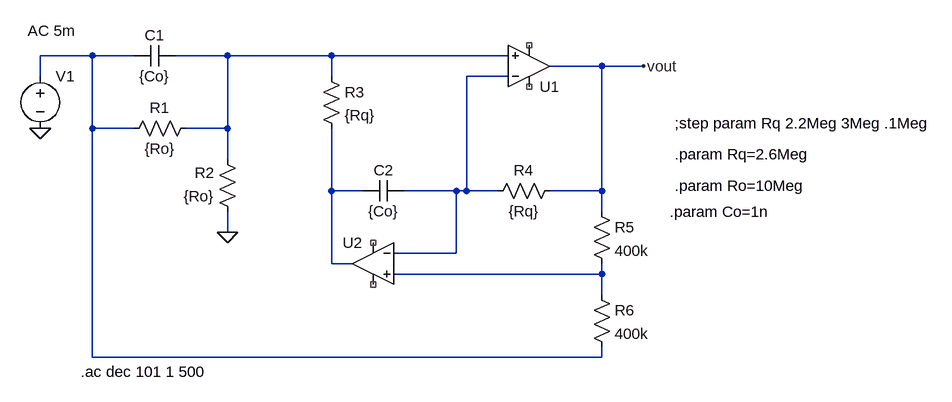
[diagram p0: schematic 60hz_notch_filter_active.asc]
60hz_notch_filter_active.asc, the LTspice schematic file:
Version 4
SHEET 1 1464 680
WIRE 144 0 64 0
WIRE 208 0 144 0
WIRE 352 0 272 0
WIRE 512 0 352 0
WIRE 784 0 512 0
WIRE 928 16 848 16
WIRE 992 16 928 16
WIRE 64 32 64 0
WIRE 512 32 512 0
WIRE 784 32 720 32
WIRE 144 112 144 0
WIRE 208 112 144 112
WIRE 352 112 352 0
WIRE 352 112 288 112
WIRE 352 160 352 112
WIRE 512 208 512 112
WIRE 560 208 512 208
WIRE 704 208 624 208
WIRE 720 208 720 32
WIRE 720 208 704 208
WIRE 768 208 720 208
WIRE 928 208 928 16
WIRE 928 208 848 208
WIRE 928 240 928 208
WIRE 352 272 352 240
WIRE 704 304 704 208
WIRE 704 304 608 304
WIRE 512 320 512 208
WIRE 544 320 512 320
WIRE 928 336 928 320
WIRE 928 336 608 336
WIRE 928 368 928 336
WIRE 144 464 144 112
WIRE 928 464 928 448
WIRE 928 464 144 464
FLAG 64 112 0
FLAG 352 272 0
FLAG 992 16 vout
SYMBOL voltage 64 16 R0
WINDOW 123 -19 -54 Left 2
WINDOW 39 0 0 Left 0
SYMATTR InstName V1
SYMATTR Value ""
SYMATTR Value2 AC 5m
SYMBOL cap 272 -16 R90
WINDOW 0 0 32 VBottom 2
WINDOW 3 32 32 VTop 2
SYMATTR InstName C1
SYMATTR Value {Co}
SYMBOL res 304 96 R90
WINDOW 0 0 56 VBottom 2
WINDOW 3 32 56 VTop 2
SYMATTR InstName R1
SYMATTR Value {Ro}
SYMBOL res 368 256 R180
WINDOW 0 36 76 Left 2
WINDOW 3 36 40 Left 2
SYMATTR InstName R2
SYMATTR Value {Ro}
SYMBOL res 496 16 R0
SYMATTR InstName R3
SYMATTR Value {Rq}
SYMBOL cap 624 192 R90
WINDOW 0 0 32 VBottom 2
WINDOW 3 32 32 VTop 2
SYMATTR InstName C2
SYMATTR Value {Co}
SYMBOL Opamps\\UniversalOpamp2 816 16 M180
SYMATTR InstName U1
SYMBOL Opamps\\UniversalOpamp2 576 320 M0
SYMATTR InstName U2
SYMBOL res 864 192 R90
WINDOW 0 0 56 VBottom 2
WINDOW 3 32 56 VTop 2
SYMATTR InstName R4
SYMATTR Value {Rq}
SYMBOL res 912 224 R0
SYMATTR InstName R5
SYMATTR Value 400k
SYMBOL res 912 352 R0
SYMATTR InstName R6
SYMATTR Value 400k
TEXT 126 486 Left 2 !.ac dec 101 1 500
TEXT 1040 152 Left 2 !.param Rq=2.6Meg
TEXT 1040 200 Left 2 !.param Ro=10Meg
TEXT 1032 240 Left 2 !.param Co=1n
TEXT 1040 104 Left 2 !;step param Rq 2.2Meg 3Meg .1Meg

The netlist it stands for:
* 60hz_notch_filter_active.asc
V1 N001 0 AC 5m
C1 N002 N001 {Co}
R1 N002 N001 {Ro}
R2 0 N002 {Ro}
R3 N002 N004 {Rq}
C2 N003 N004 {Co}
XU1 N002 N003 NC_01 NC_02 vout level.2 Avol=1Meg GBW=10Meg Slew=10Meg ilimit=25m rail=0 Vos=0 phimargin=45 en=0 enk=0 in=0 ink=0 Rin=500Meg  ; pins IN+ IN- V+ V- OUT
XU2 N005 N003 NC_03 NC_04 N004 level.2 Avol=1Meg GBW=10Meg Slew=10Meg ilimit=25m rail=0 Vos=0 phimargin=45 en=0 enk=0 in=0 ink=0 Rin=500Meg  ; pins IN+ IN- V+ V- OUT
R4 vout N003 {Rq}
R5 vout N005 400k
R6 N005 N001 400k
.ac dec 101 1 500
.param Rq=2.6Meg
.param Ro=10Meg
.param Co=1n
;step param Rq 2.2Meg 3Meg .1Meg
.lib UniversalOpamps2.sub
.backanno
.end